# EAGLE schematic mainboard (EAGLE 5.10)
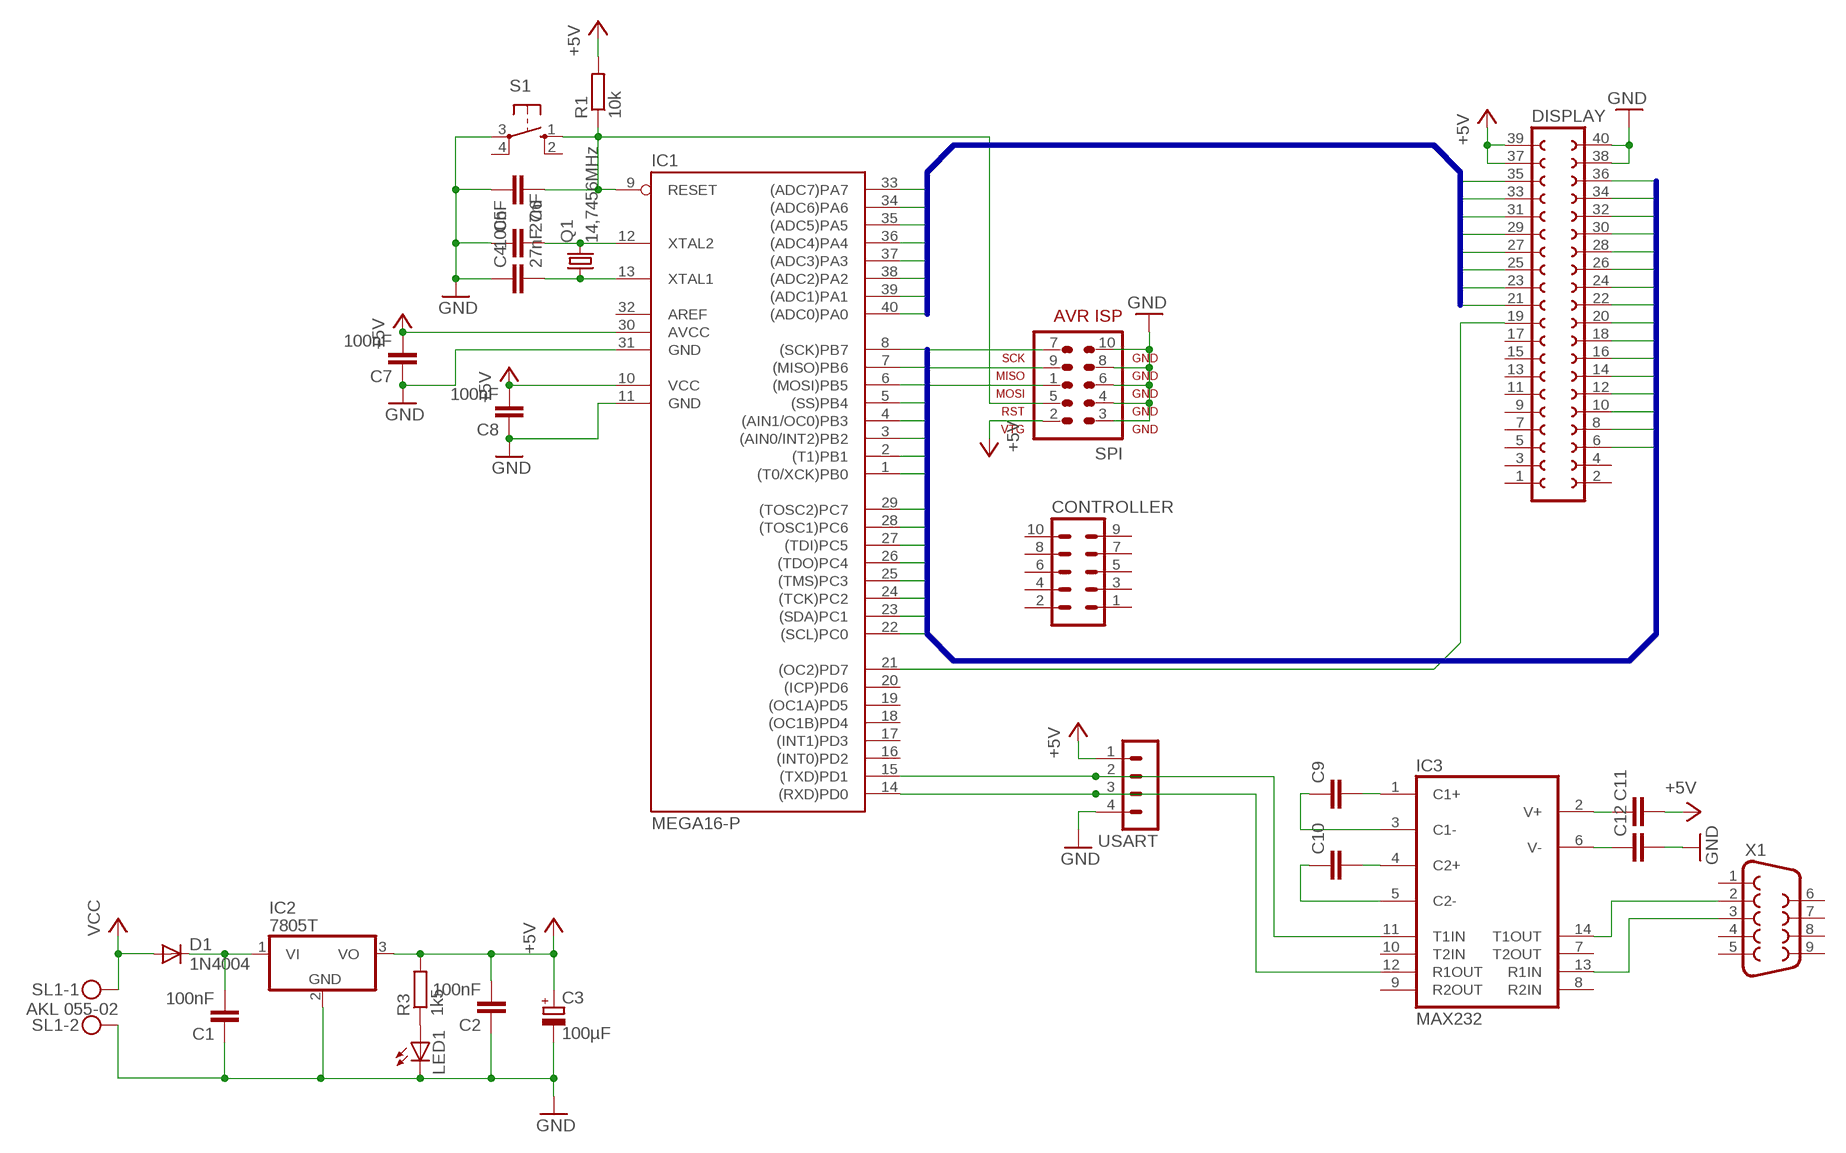
[diagram p0: schematic, sheet 1]

## Parts
C1  100nF  C-EU025-030X050  [C025-030X050]
C2  100nF  C-EU025-030X050  [C025-030X050]
C3  100µF  CPOL-EUE2.5-7  [E2,5-7]
C4  27nF  C-EU025-025X050  [C025-025X050]
C5  27nF  C-EU025-025X050  [C025-025X050]
C6  100nF  C-EU025-030X050  [C025-030X050]
C7  100nF  C-EU025-030X050  [C025-030X050]
C8  100nF  C-EU025-030X050  [C025-030X050]
C9  C-EU025-030X050  [C025-030X050]
C10  C-EU025-030X050  [C025-030X050]
C11  C-EU025-030X050  [C025-030X050]
C12  C-EU025-030X050  [C025-030X050]
CONTROLLER  MA05-2  [MA05-2]
D1  1N4004  [DO41-10]
DISPLAY  FE20-2  [FE20-2]
IC1  MEGA16-P  [DIL40]
IC2  7805T  [TO220H]
IC3  MAX232  [DIL16]
LED1  LED3MM  [LED3MM]
Q1  14,7456MHz  CRYSTALHC49U-V  [HC49U-V]
R1  10k  R-EU_0207/10  [0207/10]
R3  1k5  R-EU_0207/10  [0207/10]
S1  10-XX  [B3F-10XX]
SL1  AKL 055-02  MKDSN1,5/2-5,08  [MKDSN1,5/2-5,08]
SPI  AVR-ISP-10  [AVR-ISP-10]
USART  MA04-1  [MA04-1]
X1  F09HP  [F09HP]

## Nets
+5V: C11.2 DISPLAY.37 DISPLAY.39 USART.1
+5V_LAYER: C2.2 C3.+ C7.2 C8.2 IC1.10(VCC) IC1.30(AVCC) IC2.3(VO) R1.2 R3.2 SPI.2 ; supply symbol labelled +5V
GND: C1.1 C2.1 C3.- C4.1 C5.1 C6.2 C7.1 C8.1 C12.2 DISPLAY.38 DISPLAY.40 IC1.11(GND) IC1.31(GND) IC2.2(GND) LED1.K(C) S1.3(P) SL1.2 SPI.3 SPI.4 SPI.6 SPI.8 SPI.10 USART.4
HORIZONTAL0: DISPLAY.35 IC1.40((ADC0)PA0)
HORIZONTAL1: DISPLAY.33 IC1.39((ADC1)PA1)
HORIZONTAL2: DISPLAY.31 IC1.38((ADC2)PA2)
HORIZONTAL3: DISPLAY.29 IC1.37((ADC3)PA3)
HORIZONTAL4: DISPLAY.27 IC1.36((ADC4)PA4)
HORIZONTAL5: DISPLAY.25 IC1.35((ADC5)PA5)
HORIZONTAL6: DISPLAY.23 IC1.34((ADC6)PA6)
HORIZONTAL7: DISPLAY.21 IC1.33((ADC7)PA7)
N$1: DISPLAY.19 IC1.21((OC2)PD7)
N$2: C1.2 D1.C IC2.1(VI)
N$3: C9.2 IC3.1(C1+)
N$4: C5.2 IC1.12(XTAL2) Q1.2
N$5: C4.2 IC1.13(XTAL1) Q1.1
N$6: C9.1 IC3.3(C1-)
N$7: C10.2 IC3.4(C2+)
N$8: C10.1 IC3.5(C2-)
N$9: C11.1 IC3.2(V+)
N$10: C12.1 IC3.6(V-)
N$11: IC3.14(T1OUT) X1.2
N$12: IC3.13(R1IN) X1.3
N$16: IC1.14((RXD)PD0) IC3.12(R1OUT) USART.3
N$18: IC1.15((TXD)PD1) IC3.11(T1IN) USART.2
N$41: LED1.A R3.1
N$49: C6.1 IC1.9(RESET) R1.1 S1.1(S) SPI.5
VCC: D1.A SL1.1
VERTICAL0: DISPLAY.36 IC1.22((SCL)PC0)
VERTICAL1: DISPLAY.34 IC1.23((SDA)PC1)
VERTICAL2: DISPLAY.32 IC1.24((TCK)PC2)
VERTICAL3: DISPLAY.30 IC1.25((TMS)PC3)
VERTICAL4: DISPLAY.28 IC1.26((TDO)PC4)
VERTICAL5: DISPLAY.26 IC1.27((TDI)PC5)
VERTICAL6: DISPLAY.24 IC1.28((TOSC1)PC6)
VERTICAL7: DISPLAY.22 IC1.29((TOSC2)PC7)
VERTICAL8: DISPLAY.20 IC1.1((T0/XCK)PB0)
VERTICAL9: DISPLAY.18 IC1.2((T1)PB1)
VERTICAL10: DISPLAY.16 IC1.3((AIN0/INT2)PB2)
VERTICAL11: DISPLAY.14 IC1.4((AIN1/OC0)PB3)
VERTICAL12: DISPLAY.12 IC1.5((SS)PB4)
VERTICAL13: DISPLAY.10 IC1.6((MOSI)PB5) SPI.1
VERTICAL14: DISPLAY.8 IC1.7((MISO)PB6) SPI.9
VERTICAL15: DISPLAY.6 IC1.8((SCK)PB7) SPI.7
Unconnected: CONTROLLER.1 CONTROLLER.2 CONTROLLER.3 CONTROLLER.4 CONTROLLER.5 CONTROLLER.6 CONTROLLER.7 CONTROLLER.8 CONTROLLER.9 CONTROLLER.10 DISPLAY.1 DISPLAY.2 DISPLAY.3 DISPLAY.4 DISPLAY.5 DISPLAY.7 DISPLAY.9 DISPLAY.11 DISPLAY.13 DISPLAY.15 DISPLAY.17 IC1.16((INT0)PD2) IC1.17((INT1)PD3) IC1.18((OC1B)PD4) IC1.19((OC1A)PD5) IC1.20((ICP)PD6) IC1.32(AREF) IC3.7(T2OUT) IC3.8(R2IN) IC3.9(R2OUT) IC3.10(T2IN) S1.2(S1) S1.4(P1) X1.1 X1.4 X1.5 X1.6 X1.7 X1.8 X1.9

## Buses
HORIZONTAL[0..7]
VERTICAL[0..15]

## Power pins joined to a net without a drawn wire
GND: IC3.15(GND)
VCC: IC3.16(VCC)

## Library data of the parts
C1 C2 C4-C12 = rcl:C-EU: CAPACITOR, European symbol
C3 = resistor:CPOL-EU: POLARIZED CAPACITOR, European symbol
CONTROLLER = con-lstb:MA05-2: PIN HEADER
D1 = diode:1N4004: DIODE general purpose rectifier, 1 A
DISPLAY = con-lsta:FE20-2: FEMALE HEADER
IC1 = atmel:MEGA16-P: MICROCONTROLLER 16 Kbytes FLASH 1 kbytes SRAM 512 bytes EEPROM USART 8-channel 10 bit ADC Source: avr.lbr
IC2 = linear:78*: Positive VOLTAGE REGULATOR Source: http://cache.national.com/ds/LM/LM78L05.pdf http://www.fairchildsemi.com/ds/LM/LM7805.pdf
IC3 = maxim:MAX232: RS232 TRANSEIVER
LED1 = led:LED: LED OSRAM: - CHIPLED LG R971, LG N971, LY N971, LG Q971, LY Q971, LO R971, LY R971 LH N974, LH R974 LS Q976, LO Q976, LY Q976 LO Q996 - Hyper CHIPLED LW Q18S LB Q993, LB Q99A, LB R99A - SideLED LS A670, LO A670, LY A670, LG A670, LP A670 LB A673, LV A673, LT A673, LW A673 LH A674 LY A675 LS A676, LA A676, LO A676, LY A676, LW A676 LS A679, LY A679, LG A679 - Hyper Micro SIDELED® LS Y876, LA Y876, LO Y876, LY Y876 LT Y87S - SmartLED LW L88C, LW L88S LB L89C, LB L89S, LG L890 LS L89K, LO L89K, LY L89K LS L896, LA L896, LO L896, LY L896 - TOPLED LS T670, LO T670, LY T670, LG T670, LP T670 LSG T670, LSP T670, LSY T670, LOP T670, LYG T670 LG T671, LOG T671, LSG T671 LB T673, LV T673, LT T673, LW T673 LH T674 LS T676, LA T676, LO T676, LY T676, LB T676, LH T676, LSB T676, LW T676 LB T67C, LV T67C, LT T67C, LS T67K, LO T67K, LY T67K, LW E67C LS E67B, LA E67B, LO E67B, LY E67B, LB E67C, LV E67C, LT E67C LW T67C LS T679, LY T679, LG T679 LS T770, LO T770, LY T770, LG T770, LP T770 LB T773, LV T773, LT T773, LW T773 LH T774 LS E675, LA E675, LY E675, LS T675 LS T776, LA T776, LO T776, LY T776, LB T776 LHGB T686 LT T68C, LB T68C - Hyper Mini TOPLED® LB M676 - Mini TOPLED Santana® LG M470 LS M47K, LO M47K, LY M47K Source: http://www.osram.convergy.de LUXEON: - LUMILED® LXK2-PW12-R00, LXK2-PW12-S00, LXK2-PW14-U00, LXK2-PW14-V00 LXK2-PM12-R00, LXK2-PM12-S00, LXK2-PM14-U00 LXK2-PE12-Q00, LXK2-PE12-R00, LXK2-PE12-S00, LXK2-PE14-T00, LXK2-PE14-U00 LXK2-PB12-K00, LXK2-PB12-L00, LXK2-PB12-M00, LXK2-PB14-N00, LXK2-PB14-P00, LXK2-PB14-Q00 LXK2-PR12-L00, LXK2-PR12-M00, LXK2-PR14-Q00, LXK2-PR14-R00 LXK2-PD12-Q00, LXK2-PD12-R00, LXK2-PD12-S00 LXK2-PH12-R00, LXK2-PH12-S00 LXK2-PL12-P00, LXK2-PL12-Q00, LXK2-PL12-R00 Source: www.luxeon.com KINGBRIGHT: KA-3528ASYC Source: www.kingbright.com
Q1 = crystal:CRYSTAL: CRYSTAL
R1 R3 = rcl:R-EU_: RESISTOR, European symbol
S1 = switch-omron:10-XX: OMRON SWITCH
SL1 = con-phoenix-508:MKDSN1,5/2-5,08: MKDSN 1,5/ 2-5,08 Printklemme Nennstrom: 13,5 A Nennspannung: 250 V Rastermaß: 5,08 mm Polzahl: 2 Anschlussart: Schraubanschluss Montage: Löten Anschlussrichtung Leiter/Platine: 0 ° Artikelnummer: 1729128 Source: http://eshop.phoenixcontact.com .. 1729128.pdf
SPI = avr-5-4.16:AVR-ISP-10: AVR ISP-10 Serial Programming Header
USART = con-lstb:MA04-1: PIN HEADER
X1 = con-subd:F09: SUB-D